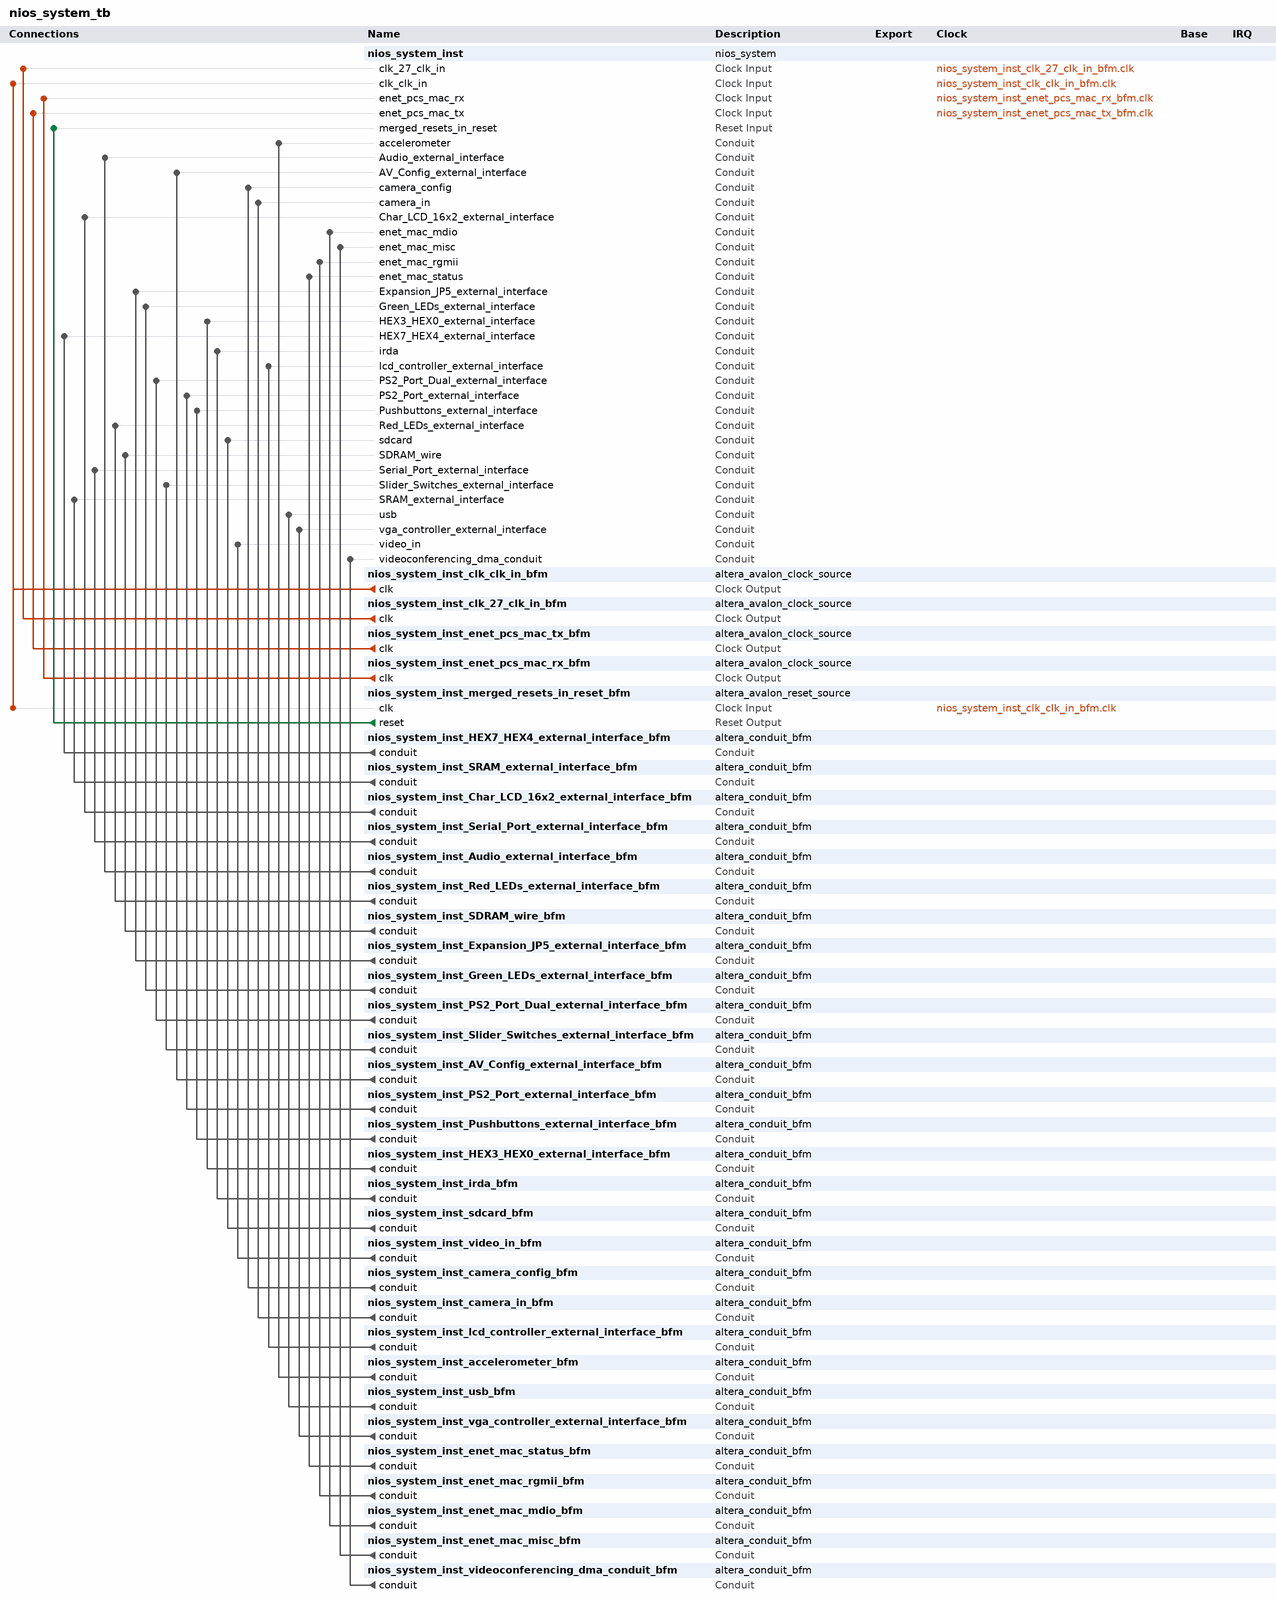
[diagram p0: system contents]
# Platform Designer (Qsys) system nios_system_tb, Cyclone IV E EP4CE115F29C7
# Parameters at their usual value, and those the tool derives, are not listed.
package require -exact qsys 13.0
create_system nios_system_tb
set_project_property DEVICE_FAMILY {Cyclone IV E}
set_project_property DEVICE EP4CE115F29C7

add_instance nios_system_inst nios_system 1.0

add_instance nios_system_inst_clk_clk_in_bfm altera_avalon_clock_source 13.0

add_instance nios_system_inst_clk_27_clk_in_bfm altera_avalon_clock_source 13.0
set_instance_parameter_value nios_system_inst_clk_27_clk_in_bfm CLOCK_RATE 27000000

add_instance nios_system_inst_enet_pcs_mac_tx_bfm altera_avalon_clock_source 13.0

add_instance nios_system_inst_enet_pcs_mac_rx_bfm altera_avalon_clock_source 13.0

add_instance nios_system_inst_merged_resets_in_reset_bfm altera_avalon_reset_source 13.0
set_instance_parameter_value nios_system_inst_merged_resets_in_reset_bfm ASSERT_HIGH_RESET 0
set_instance_parameter_value nios_system_inst_merged_resets_in_reset_bfm INITIAL_RESET_CYCLES 50

add_instance nios_system_inst_HEX7_HEX4_external_interface_bfm altera_conduit_bfm 13.0
set_instance_parameter_value nios_system_inst_HEX7_HEX4_external_interface_bfm CLOCKED_SIGNAL false
set_instance_parameter_value nios_system_inst_HEX7_HEX4_external_interface_bfm ENABLE_RESET false
set_instance_parameter_value nios_system_inst_HEX7_HEX4_external_interface_bfm SIGNAL_ROLES HEX4,HEX5,HEX6,HEX7
set_instance_parameter_value nios_system_inst_HEX7_HEX4_external_interface_bfm SIGNAL_WIDTHS 7,7,7,7
set_instance_parameter_value nios_system_inst_HEX7_HEX4_external_interface_bfm SIGNAL_DIRECTIONS input,input,input,input

add_instance nios_system_inst_SRAM_external_interface_bfm altera_conduit_bfm 13.0
set_instance_parameter_value nios_system_inst_SRAM_external_interface_bfm CLOCKED_SIGNAL false
set_instance_parameter_value nios_system_inst_SRAM_external_interface_bfm ENABLE_RESET false
set_instance_parameter_value nios_system_inst_SRAM_external_interface_bfm SIGNAL_ROLES DQ,ADDR,LB_N,UB_N,CE_N,OE_N,WE_N
set_instance_parameter_value nios_system_inst_SRAM_external_interface_bfm SIGNAL_WIDTHS 16,20,1,1,1,1,1
set_instance_parameter_value nios_system_inst_SRAM_external_interface_bfm SIGNAL_DIRECTIONS bidir,input,input,input,input,input,input

add_instance nios_system_inst_Char_LCD_16x2_external_interface_bfm altera_conduit_bfm 13.0
set_instance_parameter_value nios_system_inst_Char_LCD_16x2_external_interface_bfm CLOCKED_SIGNAL false
set_instance_parameter_value nios_system_inst_Char_LCD_16x2_external_interface_bfm ENABLE_RESET false
set_instance_parameter_value nios_system_inst_Char_LCD_16x2_external_interface_bfm SIGNAL_ROLES DATA,ON,BLON,EN,RS,RW
set_instance_parameter_value nios_system_inst_Char_LCD_16x2_external_interface_bfm SIGNAL_WIDTHS 8,1,1,1,1,1
set_instance_parameter_value nios_system_inst_Char_LCD_16x2_external_interface_bfm SIGNAL_DIRECTIONS bidir,input,input,input,input,input

add_instance nios_system_inst_Serial_Port_external_interface_bfm altera_conduit_bfm 13.0
set_instance_parameter_value nios_system_inst_Serial_Port_external_interface_bfm CLOCKED_SIGNAL false
set_instance_parameter_value nios_system_inst_Serial_Port_external_interface_bfm ENABLE_RESET false
set_instance_parameter_value nios_system_inst_Serial_Port_external_interface_bfm SIGNAL_ROLES RXD,TXD
set_instance_parameter_value nios_system_inst_Serial_Port_external_interface_bfm SIGNAL_WIDTHS 1,1
set_instance_parameter_value nios_system_inst_Serial_Port_external_interface_bfm SIGNAL_DIRECTIONS output,input

add_instance nios_system_inst_Audio_external_interface_bfm altera_conduit_bfm 13.0
set_instance_parameter_value nios_system_inst_Audio_external_interface_bfm CLOCKED_SIGNAL false
set_instance_parameter_value nios_system_inst_Audio_external_interface_bfm ENABLE_RESET false
set_instance_parameter_value nios_system_inst_Audio_external_interface_bfm SIGNAL_ROLES ADCDAT,ADCLRCK,BCLK,DACDAT,DACLRCK
set_instance_parameter_value nios_system_inst_Audio_external_interface_bfm SIGNAL_WIDTHS 1,1,1,1,1
set_instance_parameter_value nios_system_inst_Audio_external_interface_bfm SIGNAL_DIRECTIONS output,output,output,input,output

add_instance nios_system_inst_Red_LEDs_external_interface_bfm altera_conduit_bfm 13.0
set_instance_parameter_value nios_system_inst_Red_LEDs_external_interface_bfm CLOCKED_SIGNAL false
set_instance_parameter_value nios_system_inst_Red_LEDs_external_interface_bfm ENABLE_RESET false
set_instance_parameter_value nios_system_inst_Red_LEDs_external_interface_bfm SIGNAL_WIDTHS 18
set_instance_parameter_value nios_system_inst_Red_LEDs_external_interface_bfm SIGNAL_DIRECTIONS input

add_instance nios_system_inst_SDRAM_wire_bfm altera_conduit_bfm 13.0
set_instance_parameter_value nios_system_inst_SDRAM_wire_bfm CLOCKED_SIGNAL false
set_instance_parameter_value nios_system_inst_SDRAM_wire_bfm ENABLE_RESET false
set_instance_parameter_value nios_system_inst_SDRAM_wire_bfm SIGNAL_ROLES addr,ba,cas_n,cke,cs_n,dq,dqm,ras_n,we_n
set_instance_parameter_value nios_system_inst_SDRAM_wire_bfm SIGNAL_WIDTHS 13,2,1,1,1,32,4,1,1
set_instance_parameter_value nios_system_inst_SDRAM_wire_bfm SIGNAL_DIRECTIONS input,input,input,input,input,bidir,input,input,input

add_instance nios_system_inst_Expansion_JP5_external_interface_bfm altera_conduit_bfm 13.0
set_instance_parameter_value nios_system_inst_Expansion_JP5_external_interface_bfm CLOCKED_SIGNAL false
set_instance_parameter_value nios_system_inst_Expansion_JP5_external_interface_bfm ENABLE_RESET false
set_instance_parameter_value nios_system_inst_Expansion_JP5_external_interface_bfm SIGNAL_WIDTHS 32
set_instance_parameter_value nios_system_inst_Expansion_JP5_external_interface_bfm SIGNAL_DIRECTIONS bidir

add_instance nios_system_inst_Green_LEDs_external_interface_bfm altera_conduit_bfm 13.0
set_instance_parameter_value nios_system_inst_Green_LEDs_external_interface_bfm CLOCKED_SIGNAL false
set_instance_parameter_value nios_system_inst_Green_LEDs_external_interface_bfm ENABLE_RESET false
set_instance_parameter_value nios_system_inst_Green_LEDs_external_interface_bfm SIGNAL_WIDTHS 9
set_instance_parameter_value nios_system_inst_Green_LEDs_external_interface_bfm SIGNAL_DIRECTIONS input

add_instance nios_system_inst_PS2_Port_Dual_external_interface_bfm altera_conduit_bfm 13.0
set_instance_parameter_value nios_system_inst_PS2_Port_Dual_external_interface_bfm CLOCKED_SIGNAL false
set_instance_parameter_value nios_system_inst_PS2_Port_Dual_external_interface_bfm ENABLE_RESET false
set_instance_parameter_value nios_system_inst_PS2_Port_Dual_external_interface_bfm SIGNAL_ROLES CLK,DAT
set_instance_parameter_value nios_system_inst_PS2_Port_Dual_external_interface_bfm SIGNAL_WIDTHS 1,1
set_instance_parameter_value nios_system_inst_PS2_Port_Dual_external_interface_bfm SIGNAL_DIRECTIONS bidir,bidir

add_instance nios_system_inst_Slider_Switches_external_interface_bfm altera_conduit_bfm 13.0
set_instance_parameter_value nios_system_inst_Slider_Switches_external_interface_bfm CLOCKED_SIGNAL false
set_instance_parameter_value nios_system_inst_Slider_Switches_external_interface_bfm ENABLE_RESET false
set_instance_parameter_value nios_system_inst_Slider_Switches_external_interface_bfm SIGNAL_WIDTHS 18
set_instance_parameter_value nios_system_inst_Slider_Switches_external_interface_bfm SIGNAL_DIRECTIONS output

add_instance nios_system_inst_AV_Config_external_interface_bfm altera_conduit_bfm 13.0
set_instance_parameter_value nios_system_inst_AV_Config_external_interface_bfm CLOCKED_SIGNAL false
set_instance_parameter_value nios_system_inst_AV_Config_external_interface_bfm ENABLE_RESET false
set_instance_parameter_value nios_system_inst_AV_Config_external_interface_bfm SIGNAL_ROLES SDAT,SCLK
set_instance_parameter_value nios_system_inst_AV_Config_external_interface_bfm SIGNAL_WIDTHS 1,1
set_instance_parameter_value nios_system_inst_AV_Config_external_interface_bfm SIGNAL_DIRECTIONS bidir,input

add_instance nios_system_inst_PS2_Port_external_interface_bfm altera_conduit_bfm 13.0
set_instance_parameter_value nios_system_inst_PS2_Port_external_interface_bfm CLOCKED_SIGNAL false
set_instance_parameter_value nios_system_inst_PS2_Port_external_interface_bfm ENABLE_RESET false
set_instance_parameter_value nios_system_inst_PS2_Port_external_interface_bfm SIGNAL_ROLES CLK,DAT
set_instance_parameter_value nios_system_inst_PS2_Port_external_interface_bfm SIGNAL_WIDTHS 1,1
set_instance_parameter_value nios_system_inst_PS2_Port_external_interface_bfm SIGNAL_DIRECTIONS bidir,bidir

add_instance nios_system_inst_Pushbuttons_external_interface_bfm altera_conduit_bfm 13.0
set_instance_parameter_value nios_system_inst_Pushbuttons_external_interface_bfm CLOCKED_SIGNAL false
set_instance_parameter_value nios_system_inst_Pushbuttons_external_interface_bfm ENABLE_RESET false
set_instance_parameter_value nios_system_inst_Pushbuttons_external_interface_bfm SIGNAL_WIDTHS 4
set_instance_parameter_value nios_system_inst_Pushbuttons_external_interface_bfm SIGNAL_DIRECTIONS output

add_instance nios_system_inst_HEX3_HEX0_external_interface_bfm altera_conduit_bfm 13.0
set_instance_parameter_value nios_system_inst_HEX3_HEX0_external_interface_bfm CLOCKED_SIGNAL false
set_instance_parameter_value nios_system_inst_HEX3_HEX0_external_interface_bfm ENABLE_RESET false
set_instance_parameter_value nios_system_inst_HEX3_HEX0_external_interface_bfm SIGNAL_ROLES HEX0,HEX1,HEX2,HEX3
set_instance_parameter_value nios_system_inst_HEX3_HEX0_external_interface_bfm SIGNAL_WIDTHS 7,7,7,7
set_instance_parameter_value nios_system_inst_HEX3_HEX0_external_interface_bfm SIGNAL_DIRECTIONS input,input,input,input

add_instance nios_system_inst_irda_bfm altera_conduit_bfm 13.0
set_instance_parameter_value nios_system_inst_irda_bfm CLOCKED_SIGNAL false
set_instance_parameter_value nios_system_inst_irda_bfm ENABLE_RESET false
set_instance_parameter_value nios_system_inst_irda_bfm SIGNAL_ROLES TXD,RXD
set_instance_parameter_value nios_system_inst_irda_bfm SIGNAL_WIDTHS 1,1
set_instance_parameter_value nios_system_inst_irda_bfm SIGNAL_DIRECTIONS input,output

add_instance nios_system_inst_sdcard_bfm altera_conduit_bfm 13.0
set_instance_parameter_value nios_system_inst_sdcard_bfm CLOCKED_SIGNAL false
set_instance_parameter_value nios_system_inst_sdcard_bfm ENABLE_RESET false
set_instance_parameter_value nios_system_inst_sdcard_bfm SIGNAL_ROLES b_SD_cmd,b_SD_dat,b_SD_dat3,o_SD_clock
set_instance_parameter_value nios_system_inst_sdcard_bfm SIGNAL_WIDTHS 1,1,1,1
set_instance_parameter_value nios_system_inst_sdcard_bfm SIGNAL_DIRECTIONS bidir,bidir,bidir,input

add_instance nios_system_inst_video_in_bfm altera_conduit_bfm 13.0
set_instance_parameter_value nios_system_inst_video_in_bfm CLOCKED_SIGNAL false
set_instance_parameter_value nios_system_inst_video_in_bfm ENABLE_RESET false
set_instance_parameter_value nios_system_inst_video_in_bfm SIGNAL_ROLES TD_CLK27,TD_DATA,TD_HS,TD_VS,clk27_reset,TD_RESET,overflow_flag
set_instance_parameter_value nios_system_inst_video_in_bfm SIGNAL_WIDTHS 1,8,1,1,1,1,1
set_instance_parameter_value nios_system_inst_video_in_bfm SIGNAL_DIRECTIONS output,output,output,output,output,input,input

add_instance nios_system_inst_camera_config_bfm altera_conduit_bfm 13.0
set_instance_parameter_value nios_system_inst_camera_config_bfm CLOCKED_SIGNAL false
set_instance_parameter_value nios_system_inst_camera_config_bfm ENABLE_RESET false
set_instance_parameter_value nios_system_inst_camera_config_bfm SIGNAL_ROLES I2C_SDAT,I2C_SCLK,exposure
set_instance_parameter_value nios_system_inst_camera_config_bfm SIGNAL_WIDTHS 1,1,16
set_instance_parameter_value nios_system_inst_camera_config_bfm SIGNAL_DIRECTIONS bidir,input,output

add_instance nios_system_inst_camera_in_bfm altera_conduit_bfm 13.0
set_instance_parameter_value nios_system_inst_camera_in_bfm CLOCKED_SIGNAL false
set_instance_parameter_value nios_system_inst_camera_in_bfm ENABLE_RESET false
set_instance_parameter_value nios_system_inst_camera_in_bfm SIGNAL_ROLES PIXEL_CLK,LINE_VALID,FRAME_VALID,pixel_clk_reset,PIXEL_DATA
set_instance_parameter_value nios_system_inst_camera_in_bfm SIGNAL_WIDTHS 1,1,1,1,12
set_instance_parameter_value nios_system_inst_camera_in_bfm SIGNAL_DIRECTIONS output,output,output,output,output

add_instance nios_system_inst_lcd_controller_external_interface_bfm altera_conduit_bfm 13.0
set_instance_parameter_value nios_system_inst_lcd_controller_external_interface_bfm CLOCKED_SIGNAL false
set_instance_parameter_value nios_system_inst_lcd_controller_external_interface_bfm ENABLE_RESET false
set_instance_parameter_value nios_system_inst_lcd_controller_external_interface_bfm SIGNAL_ROLES CLK,HS,VS,DATA_EN,R,G,B
set_instance_parameter_value nios_system_inst_lcd_controller_external_interface_bfm SIGNAL_WIDTHS 1,1,1,1,8,8,8
set_instance_parameter_value nios_system_inst_lcd_controller_external_interface_bfm SIGNAL_DIRECTIONS input,input,input,input,input,input,input

add_instance nios_system_inst_accelerometer_bfm altera_conduit_bfm 13.0
set_instance_parameter_value nios_system_inst_accelerometer_bfm CLOCKED_SIGNAL false
set_instance_parameter_value nios_system_inst_accelerometer_bfm ENABLE_RESET false
set_instance_parameter_value nios_system_inst_accelerometer_bfm SIGNAL_ROLES I2C_SDAT,I2C_SCLK,G_SENSOR_CS_N,G_SENSOR_INT
set_instance_parameter_value nios_system_inst_accelerometer_bfm SIGNAL_WIDTHS 1,1,1,1
set_instance_parameter_value nios_system_inst_accelerometer_bfm SIGNAL_DIRECTIONS bidir,input,input,output

add_instance nios_system_inst_usb_bfm altera_conduit_bfm 13.0
set_instance_parameter_value nios_system_inst_usb_bfm CLOCKED_SIGNAL false
set_instance_parameter_value nios_system_inst_usb_bfm ENABLE_RESET false
set_instance_parameter_value nios_system_inst_usb_bfm SIGNAL_ROLES INT1,DATA,RST_N,ADDR,CS_N,RD_N,WR_N,INT0
set_instance_parameter_value nios_system_inst_usb_bfm SIGNAL_WIDTHS 1,16,1,2,1,1,1,1
set_instance_parameter_value nios_system_inst_usb_bfm SIGNAL_DIRECTIONS output,bidir,input,input,input,input,input,output

add_instance nios_system_inst_vga_controller_external_interface_bfm altera_conduit_bfm 13.0
set_instance_parameter_value nios_system_inst_vga_controller_external_interface_bfm CLOCKED_SIGNAL false
set_instance_parameter_value nios_system_inst_vga_controller_external_interface_bfm ENABLE_RESET false
set_instance_parameter_value nios_system_inst_vga_controller_external_interface_bfm SIGNAL_ROLES CLK,HS,VS,BLANK,SYNC,R,G,B
set_instance_parameter_value nios_system_inst_vga_controller_external_interface_bfm SIGNAL_WIDTHS 1,1,1,1,1,8,8,8
set_instance_parameter_value nios_system_inst_vga_controller_external_interface_bfm SIGNAL_DIRECTIONS input,input,input,input,input,input,input,input

add_instance nios_system_inst_enet_mac_status_bfm altera_conduit_bfm 13.0
set_instance_parameter_value nios_system_inst_enet_mac_status_bfm CLOCKED_SIGNAL false
set_instance_parameter_value nios_system_inst_enet_mac_status_bfm ENABLE_RESET false
set_instance_parameter_value nios_system_inst_enet_mac_status_bfm SIGNAL_ROLES set_10,set_1000,eth_mode,ena_10
set_instance_parameter_value nios_system_inst_enet_mac_status_bfm SIGNAL_WIDTHS 1,1,1,1
set_instance_parameter_value nios_system_inst_enet_mac_status_bfm SIGNAL_DIRECTIONS output,output,input,input

add_instance nios_system_inst_enet_mac_rgmii_bfm altera_conduit_bfm 13.0
set_instance_parameter_value nios_system_inst_enet_mac_rgmii_bfm CLOCKED_SIGNAL false
set_instance_parameter_value nios_system_inst_enet_mac_rgmii_bfm ENABLE_RESET false
set_instance_parameter_value nios_system_inst_enet_mac_rgmii_bfm SIGNAL_ROLES rgmii_in,rgmii_out,rx_control,tx_control
set_instance_parameter_value nios_system_inst_enet_mac_rgmii_bfm SIGNAL_WIDTHS 4,4,1,1
set_instance_parameter_value nios_system_inst_enet_mac_rgmii_bfm SIGNAL_DIRECTIONS output,input,output,input

add_instance nios_system_inst_enet_mac_mdio_bfm altera_conduit_bfm 13.0
set_instance_parameter_value nios_system_inst_enet_mac_mdio_bfm CLOCKED_SIGNAL false
set_instance_parameter_value nios_system_inst_enet_mac_mdio_bfm ENABLE_RESET false
set_instance_parameter_value nios_system_inst_enet_mac_mdio_bfm SIGNAL_ROLES mdc,mdio_in,mdio_out,mdio_oen
set_instance_parameter_value nios_system_inst_enet_mac_mdio_bfm SIGNAL_WIDTHS 1,1,1,1
set_instance_parameter_value nios_system_inst_enet_mac_mdio_bfm SIGNAL_DIRECTIONS input,output,input,input

add_instance nios_system_inst_enet_mac_misc_bfm altera_conduit_bfm 13.0
set_instance_parameter_value nios_system_inst_enet_mac_misc_bfm CLOCKED_SIGNAL false
set_instance_parameter_value nios_system_inst_enet_mac_misc_bfm ENABLE_RESET false
set_instance_parameter_value nios_system_inst_enet_mac_misc_bfm SIGNAL_ROLES xon_gen,xoff_gen,magic_wakeup,magic_sleep_n,ff_tx_crc_fwd,ff_tx_septy,tx_ff_uflow,ff_tx_a_full,ff_tx_a_empty,rx_err_stat,rx_frm_type,ff_rx_dsav,ff_rx_a_full,ff_rx_a_empty
set_instance_parameter_value nios_system_inst_enet_mac_misc_bfm SIGNAL_WIDTHS 1,1,1,1,1,1,1,1,1,18,4,1,1,1
set_instance_parameter_value nios_system_inst_enet_mac_misc_bfm SIGNAL_DIRECTIONS output,output,input,output,output,input,input,input,input,input,input,input,input,input

add_instance nios_system_inst_videoconferencing_dma_conduit_bfm altera_conduit_bfm 13.0
set_instance_parameter_value nios_system_inst_videoconferencing_dma_conduit_bfm CLOCKED_SIGNAL false
set_instance_parameter_value nios_system_inst_videoconferencing_dma_conduit_bfm ENABLE_RESET false
set_instance_parameter_value nios_system_inst_videoconferencing_dma_conduit_bfm SIGNAL_ROLES LEDR_conduit,LEDG_conduit,HEX0_conduit,HEX1_conduit,HEX2_conduit,HEX3_conduit,HEX4_conduit,HEX5_conduit,HEX6_conduit,HEX7_conduit,SW_conduit
set_instance_parameter_value nios_system_inst_videoconferencing_dma_conduit_bfm SIGNAL_WIDTHS 18,8,7,7,7,7,7,7,7,7,18
set_instance_parameter_value nios_system_inst_videoconferencing_dma_conduit_bfm SIGNAL_DIRECTIONS input,input,input,input,input,input,input,input,input,input,output

# connections
add_connection nios_system_inst_clk_27_clk_in_bfm.clk nios_system_inst.clk_27_clk_in clock
add_connection nios_system_inst_clk_clk_in_bfm.clk nios_system_inst.clk_clk_in clock
add_connection nios_system_inst_clk_clk_in_bfm.clk nios_system_inst_merged_resets_in_reset_bfm.clk clock
add_connection nios_system_inst_enet_pcs_mac_rx_bfm.clk nios_system_inst.enet_pcs_mac_rx clock
add_connection nios_system_inst_enet_pcs_mac_tx_bfm.clk nios_system_inst.enet_pcs_mac_tx clock
add_connection nios_system_inst_merged_resets_in_reset_bfm.reset nios_system_inst.merged_resets_in_reset reset
add_connection nios_system_inst_accelerometer_bfm.conduit nios_system_inst.accelerometer conduit
add_connection nios_system_inst_Audio_external_interface_bfm.conduit nios_system_inst.Audio_external_interface conduit
add_connection nios_system_inst_AV_Config_external_interface_bfm.conduit nios_system_inst.AV_Config_external_interface conduit
add_connection nios_system_inst_camera_config_bfm.conduit nios_system_inst.camera_config conduit
add_connection nios_system_inst_camera_in_bfm.conduit nios_system_inst.camera_in conduit
add_connection nios_system_inst_Char_LCD_16x2_external_interface_bfm.conduit nios_system_inst.Char_LCD_16x2_external_interface conduit
add_connection nios_system_inst_enet_mac_mdio_bfm.conduit nios_system_inst.enet_mac_mdio conduit
add_connection nios_system_inst_enet_mac_misc_bfm.conduit nios_system_inst.enet_mac_misc conduit
add_connection nios_system_inst_enet_mac_rgmii_bfm.conduit nios_system_inst.enet_mac_rgmii conduit
add_connection nios_system_inst_enet_mac_status_bfm.conduit nios_system_inst.enet_mac_status conduit
add_connection nios_system_inst_Expansion_JP5_external_interface_bfm.conduit nios_system_inst.Expansion_JP5_external_interface conduit
add_connection nios_system_inst_Green_LEDs_external_interface_bfm.conduit nios_system_inst.Green_LEDs_external_interface conduit
add_connection nios_system_inst_HEX3_HEX0_external_interface_bfm.conduit nios_system_inst.HEX3_HEX0_external_interface conduit
add_connection nios_system_inst_HEX7_HEX4_external_interface_bfm.conduit nios_system_inst.HEX7_HEX4_external_interface conduit
add_connection nios_system_inst_irda_bfm.conduit nios_system_inst.irda conduit
add_connection nios_system_inst_lcd_controller_external_interface_bfm.conduit nios_system_inst.lcd_controller_external_interface conduit
add_connection nios_system_inst_PS2_Port_Dual_external_interface_bfm.conduit nios_system_inst.PS2_Port_Dual_external_interface conduit
add_connection nios_system_inst_PS2_Port_external_interface_bfm.conduit nios_system_inst.PS2_Port_external_interface conduit
add_connection nios_system_inst_Pushbuttons_external_interface_bfm.conduit nios_system_inst.Pushbuttons_external_interface conduit
add_connection nios_system_inst_Red_LEDs_external_interface_bfm.conduit nios_system_inst.Red_LEDs_external_interface conduit
add_connection nios_system_inst_sdcard_bfm.conduit nios_system_inst.sdcard conduit
add_connection nios_system_inst_SDRAM_wire_bfm.conduit nios_system_inst.SDRAM_wire conduit
add_connection nios_system_inst_Serial_Port_external_interface_bfm.conduit nios_system_inst.Serial_Port_external_interface conduit
add_connection nios_system_inst_Slider_Switches_external_interface_bfm.conduit nios_system_inst.Slider_Switches_external_interface conduit
add_connection nios_system_inst_SRAM_external_interface_bfm.conduit nios_system_inst.SRAM_external_interface conduit
add_connection nios_system_inst_usb_bfm.conduit nios_system_inst.usb conduit
add_connection nios_system_inst_vga_controller_external_interface_bfm.conduit nios_system_inst.vga_controller_external_interface conduit
add_connection nios_system_inst_video_in_bfm.conduit nios_system_inst.video_in conduit
add_connection nios_system_inst_videoconferencing_dma_conduit_bfm.conduit nios_system_inst.videoconferencing_dma_conduit conduit

set_interconnect_requirement {$system} qsys_mm.clockCrossingAdapter HANDSHAKE
set_interconnect_requirement {$system} qsys_mm.maxAdditionalLatency 1

save_system nios_system_tb.qsys
